# Altium schematic sheet Xbee.SchDoc: XBee Radio
size A; DocumentNumber: 4; SheetNumber: 4; SheetTotal: 11
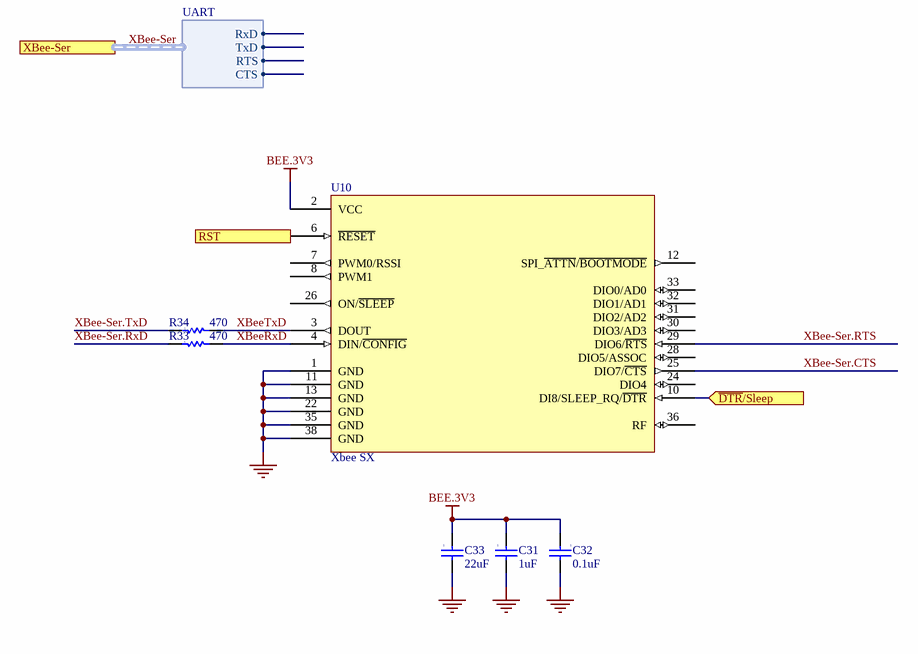
[diagram p0: Xbee.SchDoc]

## Parts
C31  value 1uF  [0603]  (hidden comment: Cap)
C32  value 0.1uF  [0402]  (hidden comment: Cap)
C33  value 22uF  [1206]  (hidden comment: Cap)
R33  value 470  [R0402]  (hidden comment: Res)
R34  value 470  [R0402]  (hidden comment: Res)
U10  Xbee SX  [XBP9X-DMUS-001]

## Ports
RST (in), XBee-Ser (harness UART), ~{DTR}/Sleep (in)

## Harnesses
UART: RxD, TxD, CTS, RTS

## Nets
BEE.3V3: C31.1 C32.1 C33.1 U10.2(VCC)
GND: C31.2 C32.2 C33.2 U10.1(GND) U10.11(GND) U10.13(GND) U10.22(GND) U10.35(GND) U10.38(GND)
~{DTR}/Sleep: U10.10(DI8/SLEEP_RQ/~{DTR}) ; port ~{DTR}/Sleep
RST: U10.6(~{RESET}) ; port RST
XBee-Ser.CTS: U10.25(DIO7/~{CTS})
XBee-Ser.RTS: U10.29(DIO6/~{RTS})
XBee-Ser.RxD: R33.1
XBee-Ser.TxD: R34.1
XBeeRxD: R33.2 U10.4(DIN/~{CONFIG})
XBeeTxD: R34.2 U10.3(DOUT)

Not connected (* = marked no-connect by the designer): U10 7(PWM0/RSSI) 8(PWM1) 12(SPI_~{ATTN}/~{BOOTMODE}) 24(DIO4) 26(ON/~{SLEEP}) 28(DIO5/ASSOC) 30(DIO3/AD3) 31(DIO2/AD2) 32(DIO1/AD1) 33(DIO0/AD0) 36(RF)

## Buses and harness runs
harness XBee-Ser = port XBee-Ser

## Notes on the sheet
- Date
- Sheet
- Project
- Time
- PCB
- Assy
- of
- Size
- A
- File

## Library data of the parts
C31 = Cap: CAP CER 1UF 25V X7R 0603; Manufacturer: Samsung; Manufacturer Part Number: CL10B105KA8NNNC; Tolerance: 10%; Published: 8-Jun-2000; LatestRevisionDate: 17-Jul-2002; LatestRevisionNote: Re-released for DXP Platform.; Publisher: Altium Limited; Category: Capacitors; Supplier 1: Digi-Key; Supplier Part Number 1: 1276-1184-6-ND; Stock 1: 0; Pricing 1: 1=0.1, 10=0.069, 100=0.0306, 500=0.02188, 1000=0.01719 (USD); Mount: Surface Mount; Case/Package: 0603; Case Code (Metric): 1608; Case Code (Imperial): 0603; Contact Plating: Tin; Min Operating Temperature: -55°C; Max Operating Temperature: 125°C; Capacitance: 1uF; Dielectric: X7R; Packaging: Tape and Reel; Voltage Rating: 25V; Package Quantity: 1; Voltage: 25V; Length: 1.6mm; Height: 0.8mm; Width: 0.031inch; Thickness: 0.035inch; Depth: 0.8mm; Radiation Hardening: No; ComponentLink1URL: https://datasheet.ciiva.com/16449/cl10b105ka8nnnc-16449544.pdf; ComponentLink1Description: https://datasheet.ciiva.com/16449/cl10b105ka8nnnc-16449544.pdf; ComponentLink2URL: https://datasheet.ciiva.com/15195/getdatasheetpartid-359554-15195726.pdf; ComponentLink2Description: https://datasheet.ciiva.com/15195/getdatasheetpartid-359554-15195726.pdf
C32 = Cap: CAP CER .10UF 50V X7R 10% 0402; Manufacturer: TDK Corporation; Manufacturer Part Number: C1005X7R1H104K; Capacitance: 0.1µF; Published: 8-Jun-2000; LatestRevisionDate: 17-Jul-2002; LatestRevisionNote: Re-released for DXP Platform.; Publisher: Altium Limited; Category: Capacitors; Supplier 1: Digi-Key; Supplier Part Number 1: 445-5932-1-ND; RoHS: RoHS Compliant; Stock 1: 174080; Pricing 1: 1=0.3, 10=0.2, 100=0.08, 250=0.05752, 500=0.041, 1000=0.03 (USD); Voltage - Rated: 50V; Tolerance: ±10%; Temperature Coefficient: X7R; Mounting Type: Surface Mount, MLCC; Operating Temperature: -55°C ~ 125°C; Applications: General Purpose; Ratings: -; Package / Case: 0402 (1005 Metric); Size / Dimension: 0.039" L x 0.020" W (1.00mm x 0.50mm); Height: -; Thickness: 0.022" (0.55mm); Lead Spacing: -; Features: -; Packaging: Cut Tape (CT); Lead Style: -; ComponentLink1URL: http://www.tdk.co.jp/tefe02/e412_c.pdf; ComponentLink1Description: http://www.tdk.co.jp/tefe02/e412_c.pdf
C33 = Cap: CAP CER 22UF 10V X5R 1206; Manufacturer: Samsung; Manufacturer Part Number: CL31A226KPHNNNE; Tolerance: 10%; ComponentLink1URL: http://www.murata.com/~/media/webrenewal/products/inductor/chip/tokoproducts/wirewoundmetalalloychiptype/m_dfe252012f.ashx; ComponentLink1Description: http://www.murata.com/~/media/webrenewal/products/inductor/chip/tokoproducts/wirewoundmetalalloychiptype/m_dfe252012f.ashx; ComponentLink2URL: https://www.murata.com/~/media/webrenewal/products/inductor/chip/tokoproducts/wirewoundmetalalloychiptype/m_dfe252012f.ashx; ComponentLink2Description: https://www.murata.com/~/media/webrenewal/products/inductor/chip/tokoproducts/wirewoundmetalalloychiptype/m_dfe252012f.ashx; Supplier 1: Digi-Key; Supplier Part Number 1: 1276-1287-6-ND; Stock 1: 46; Pricing 1: 1=0.42, 10=0.289, 100=0.1638, 500=0.1156, 1000=0.10114 (USD); Mount: Surface Mount; Case/Package: 1206; Case Code (Metric): 3216; Case Code (Imperial): 1206; Min Operating Temperature: -55°C; Max Operating Temperature: 85°C; Packaging: Tape and Reel; Package Quantity: 1; Capacitance: 22uF; Voltage Rating: 10V; Dielectric: X5R; Voltage Rating (DC): 10V; Length: 3.2mm; Height: 1.6mm; Width: 0.063inch; Thickness: 0.071inch; Depth: 1.6mm; Radiation Hardening: No; Lead Free: Lead Free; ComponentLink3URL: https://datasheet.ciiva.com/15196/getdatasheetpartid-355211-15196000.pdf; ComponentLink3Description: https://datasheet.ciiva.com/15196/getdatasheetpartid-355211-15196000.pdf; ComponentLink4URL: https://datasheet.ciiva.com/16437/cl05b104kq5nnnc-16437214.pdf; ComponentLink4Description: https://datasheet.ciiva.com/16437/cl05b104kq5nnnc-16437214.pdf
R33 R34 = Res: RES 470 OHM 1/16W 1% 0402 SMD; Manufacturer: Vishay Dale; Manufacturer Part Number: CRCW0402470RFKED; Power (Watts): 0.063W, 1/16W; Temperature Coefficient: ±100ppm/°C; Supplier 1: Digi-Key; Supplier Part Number 1: 541-470LCT-ND; RoHS: RoHS Compliant; Category: Resistors; Stock 1: 121698; Pricing 1: 10=0.083, 50=0.0444, 200=0.0255, 1000=0.0174 (USD); Packaging: Cut Tape (CT); Resistance (Ohms): 470; Tolerance: ±1%; Composition: Thick Film; Features: Automotive AEC-Q200 Qualified; Package / Case: 0402 (1005 Metric); Supplier Device Package: 0402 (1005 Metric); Size / Dimension: 0.039" L x 0.020" W (1.00mm x 0.50mm); Height: 0.016" (0.40mm); Number of Terminations: 2; ComponentLink1URL: http://www.vishay.com/doc?20035; ComponentLink1Description: http://www.vishay.com/doc?20035
U10 = Xbee SX: XBEE PRO MOD TXRX ISM 915MHZ UFL; Manufacturer: Digi International; Frequency: 928MHz; Data Rate: 250Kbps; Sensitivity: -113dBm; Current - Receiving: 40mA; Current - Transmitting: 55mA; Supplier 1: Digi-Key; Supplier Part Number 1: 602-1890-ND; Manufacturer Part Number: XBP9X-DMUS-001; Stock 1: 681; Pricing 1: 1=99, 100=89.0003 (USD); Mount: Surface Mount; Case/Package: Module; Min Operating Temperature: -40°C; Max Operating Temperature: 85°C; Packaging: Tray; Lead Free: Lead Free